# Altium schematic sheet CAMERAv1.4.SchDoc
size A4
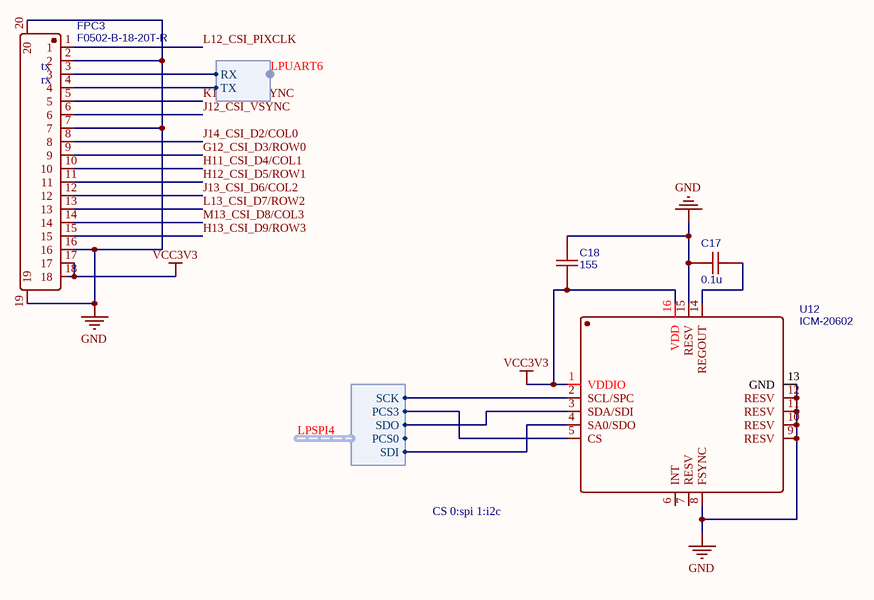
[diagram p0: CAMERAv1.4.SchDoc]

## Parts
C17  0.1u  [C0603]
C18  155  [C0603]
FPC3  F0502-B-18-20T-R  [FPC-SMD_18P-P0.50_F0502-B-18-20T-R]
U12  ICM-20602  [LGA-16_L3.0-W3.0-P0.50-BL]

## Harnesses
uart: TX, RX
SPI: SDI, SDO, SCK, PCS0, PCS3

## Nets
GND: C17.1 C18.2 FPC3.2 FPC3.7 FPC3.16 FPC3.19 FPC3.20 U12.8(FSYNC) U12.9(RESV) U12.10(RESV) U12.11(RESV) U12.12(RESV) U12.13(GND) U12.15(RESV)
VCC3V3: C18.1 FPC3.17 FPC3.18 U12.1(VDDIO) U12.16(VDD)
G12_CSI_D3/ROW0: FPC3.9
H11_CSI_D4/COL1: FPC3.10
H12_CSI_D5/ROW1: FPC3.11
H13_CSI_D9/ROW3: FPC3.15
J12_CSI_VSYNC: FPC3.6
J13_CSI_D6/COL2: FPC3.12
J14_CSI_D2/COL0: FPC3.8
K10_CSI_HSYNC: FPC3.5
L12_CSI_PIXCLK: FPC3.1
L13_CSI_D7/ROW2: FPC3.13
LPSPI4.PCS3: U12.5(CS) ; harness SPI.PCS3
LPSPI4.SCK: U12.2(SCL/SPC) ; harness SPI.SCK
LPSPI4.SDI: U12.4(SA0/SDO) ; harness SPI.SDI
LPSPI4.SDO: U12.3(SDA/SDI) ; harness SPI.SDO
LPUART6.RX: FPC3.3 ; harness uart.RX
LPUART6.TX: FPC3.4 ; harness uart.TX
M13_CSI_D8/COL3: FPC3.14
NetC17_2: C17.2 U12.14(REGOUT)

Not connected (* = marked no-connect by the designer): U12 6(INT) 7(RESV)

## Notes on the sheet
- (near FPC3) tx
- (near FPC3) rx
- CS 0:spi 1:i2c

## Library data of the parts
C17 C18 = C0603: nameAlias: Value(F); Contributor: LCEDA_Lib; spicePre: C; spiceSymbolName: C_0603_US
FPC3 = F0502-B-18-20T-R: BOM_Manufacturer: XFCN; Contributor: LCSC; BOM_Supplier: LCSC; BOM_Supplier Part: C512918; BOM_Manufacturer Part: F0502-B-18-20T-R; spicePre: F; spiceSymbolName: F0502-B-18-20T-R
U12 = ICM-20602: BOM_Manufacturer: TDK InvenSense; Contributor: LCSC; SMT Type: Extend; BOM_Supplier: LCSC; BOM_Supplier Part: C97633; BOM_Manufacturer Part: ICM-20602; BOM_LCSC Assembly: Yes; spicePre: U; spiceSymbolName: ICM-20602